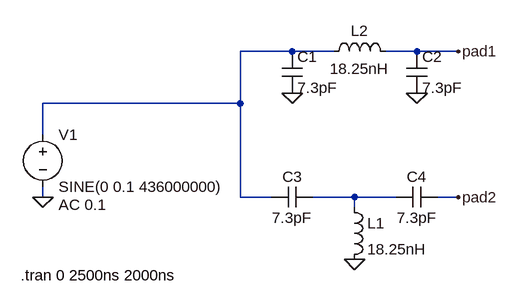
[diagram p0: schematic balun.asc]
balun.asc, the LTspice schematic file:
Version 4
SHEET 1 880 680
WIRE 160 112 80 112
WIRE 224 112 160 112
WIRE 352 112 304 112
WIRE 416 112 352 112
WIRE 80 192 80 112
WIRE 80 192 -224 192
WIRE -224 240 -224 192
WIRE -224 336 -224 320
WIRE 80 336 80 192
WIRE 128 336 80 336
WIRE 256 336 192 336
WIRE 320 336 256 336
WIRE 416 336 384 336
WIRE 256 352 256 336
FLAG -224 336 0
FLAG 416 112 pad1
FLAG 160 176 0
FLAG 352 176 0
FLAG 256 432 0
FLAG 416 336 pad2
SYMBOL cap 144 112 R0
SYMATTR InstName C1
SYMATTR Value 7.3pF
SYMBOL cap 336 112 R0
SYMATTR InstName C2
SYMATTR Value 7.3pF
SYMBOL cap 192 320 R90
WINDOW 0 0 32 VBottom 2
WINDOW 3 32 32 VTop 2
SYMATTR InstName C3
SYMATTR Value 7.3pF
SYMBOL cap 384 320 R90
WINDOW 0 0 32 VBottom 2
WINDOW 3 32 32 VTop 2
SYMATTR InstName C4
SYMATTR Value 7.3pF
SYMBOL ind 240 336 R0
SYMATTR InstName L1
SYMATTR Value 18.25nH
SYMBOL ind 208 128 R270
WINDOW 0 32 56 VTop 2
WINDOW 3 5 56 VBottom 2
SYMATTR InstName L2
SYMATTR Value 18.25nH
SYMBOL voltage -224 224 R0
WINDOW 123 24 124 Left 2
WINDOW 39 0 0 Left 0
SYMATTR InstName V1
SYMATTR Value SINE(0 0.1 436000000)
SYMATTR Value2 AC 0.1
TEXT -258 456 Left 2 !.tran 0 2500ns 2000ns

The netlist it stands for:
* balun.asc
C1 N001 0 7.3pF
C2 pad1 0 7.3pF
C3 N002 N001 7.3pF
C4 pad2 N002 7.3pF
L1 N002 0 18.25nH
L2 N001 pad1 18.25nH
V1 N001 0 SINE(0 0.1 436000000) AC 0.1
.tran 0 2500ns 2000ns
.backanno
.end